# EasyEDA schematic FuzzEffect.json
TITLE: Sheet_1; REV: 1.0; Date: 2020-06-07; Sheet: 1/1; Drawn By: samuelgossner; Company: Your Company
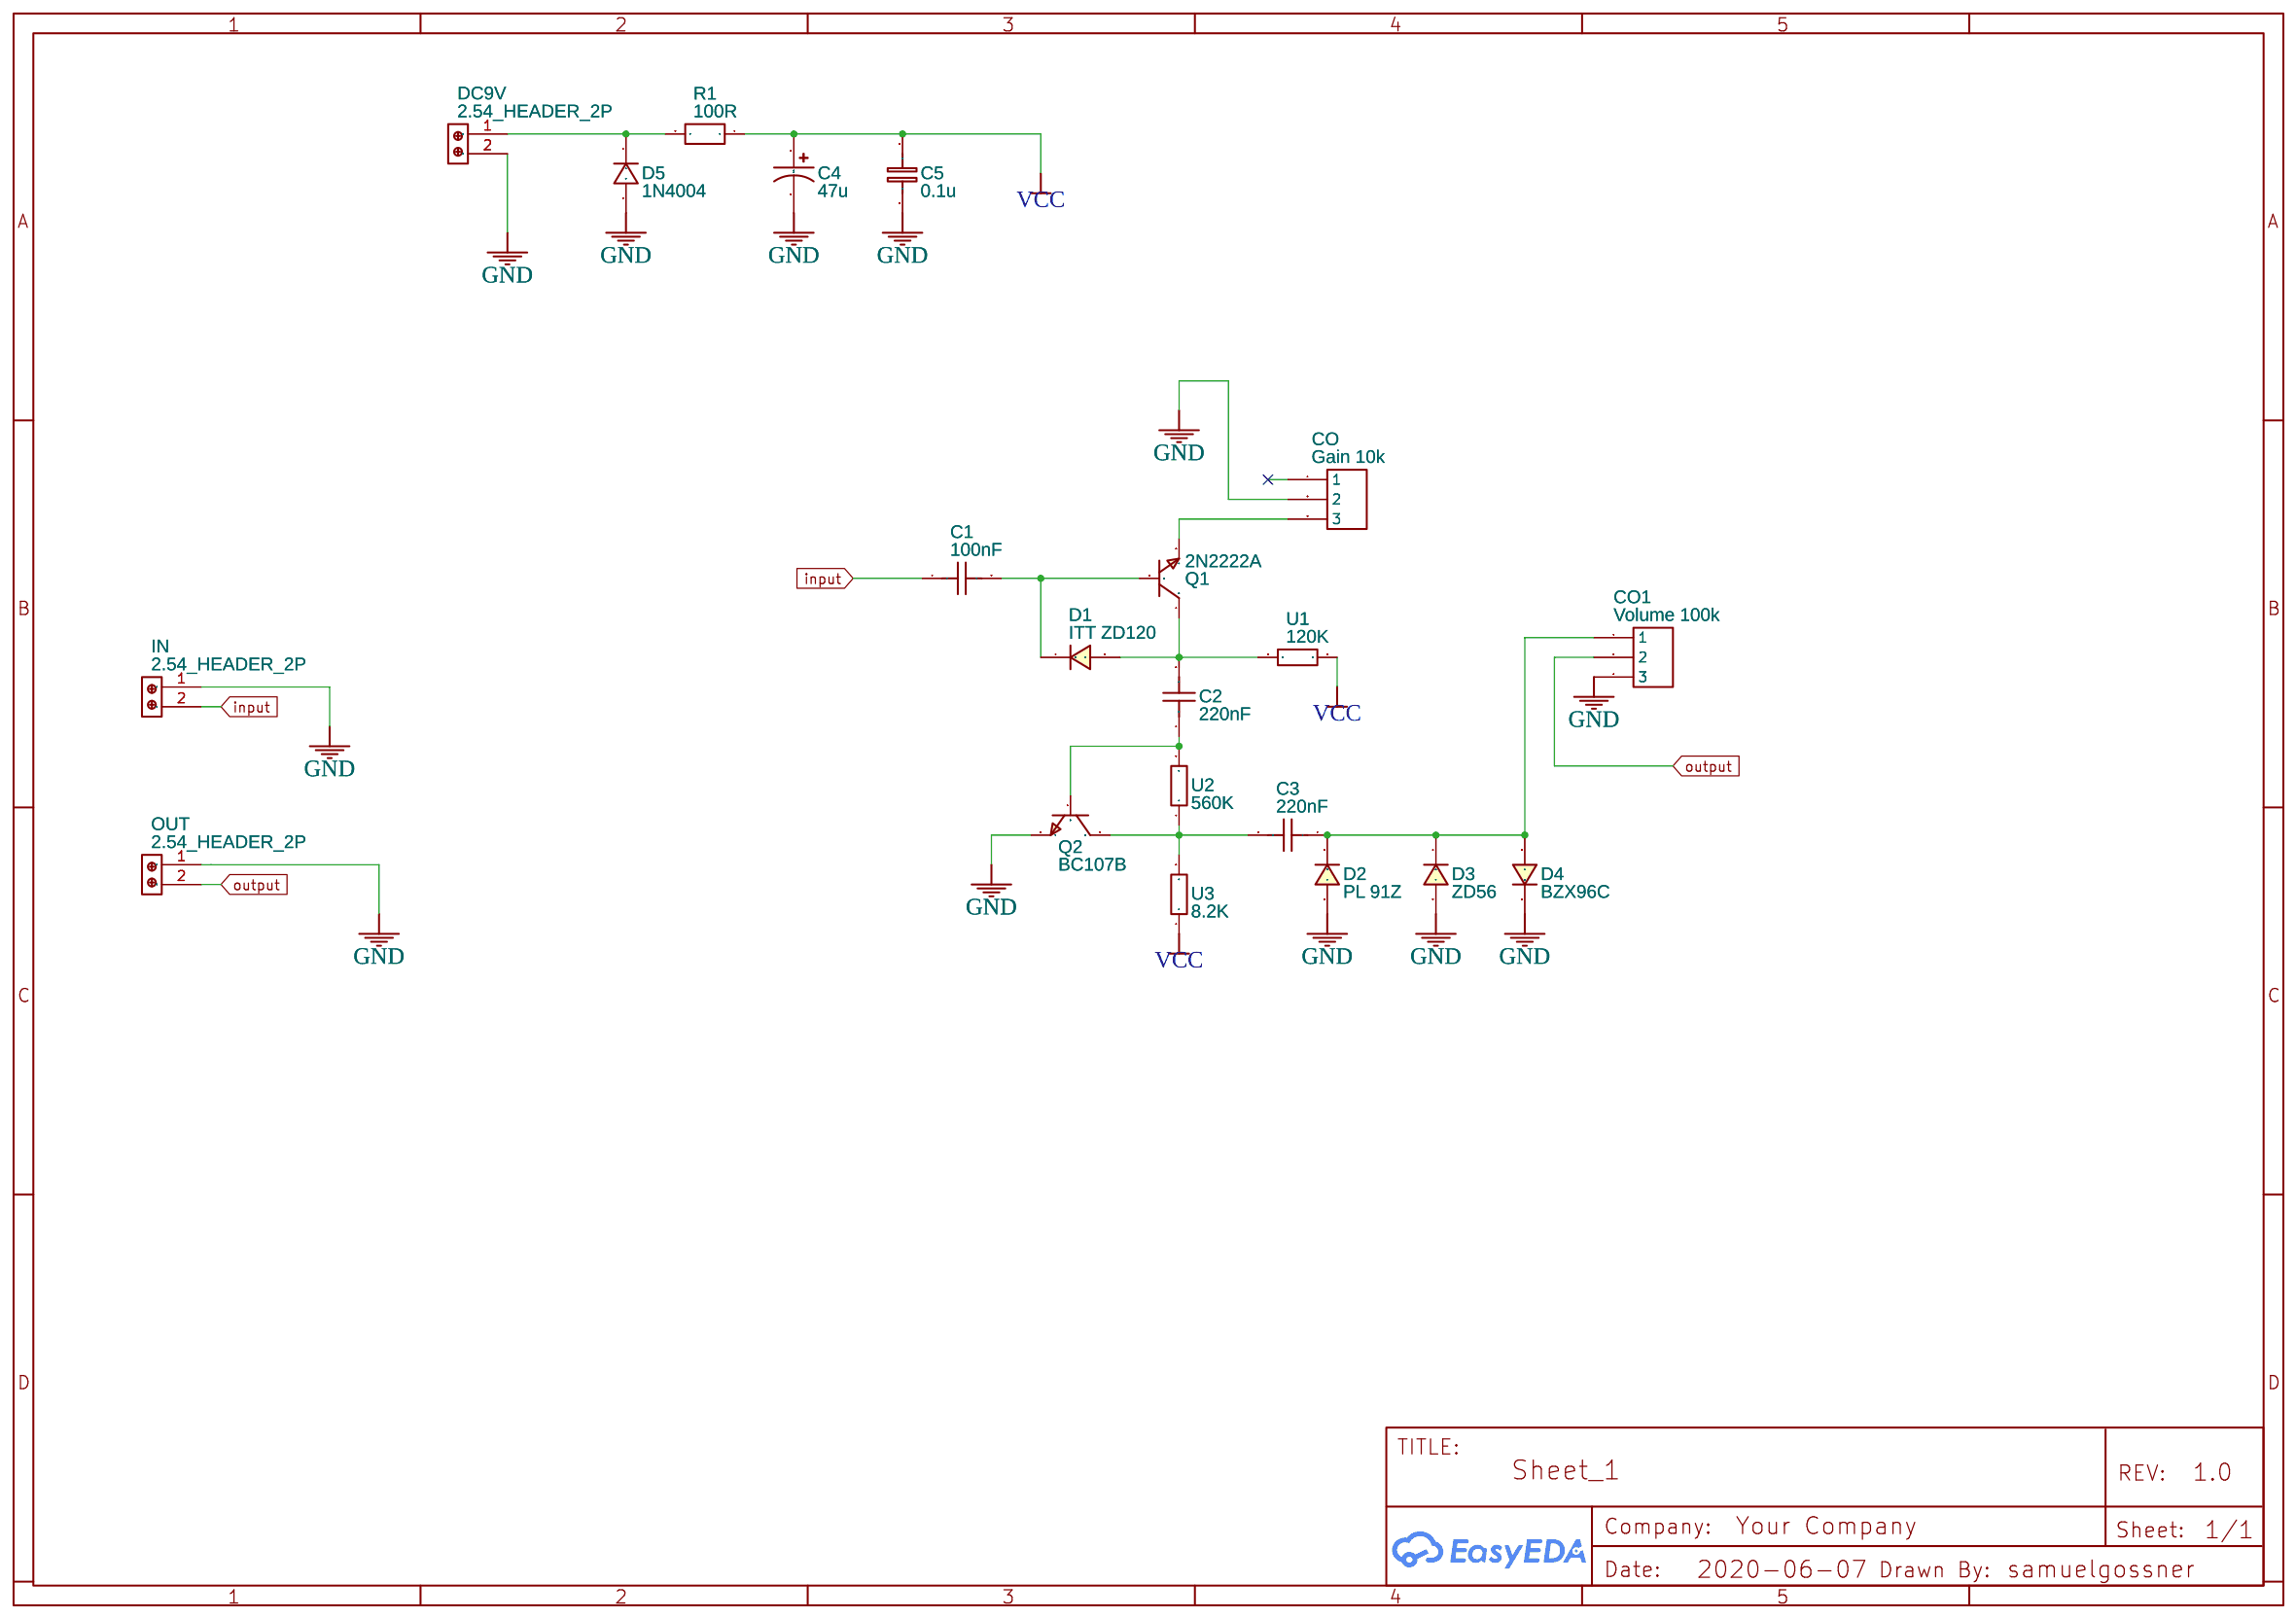
[diagram p0: schematic sheet]

## Parts
C1  100nF  [C0805]
C2  220nF  [C1206]
C3  220nF  [C1206]
C4  47u  [CASE-A_3216]
C5  0.1u  [C0603]
CO  Gain 10k  [HDR-3X1/2.54]
CO1  Volume 100k  [HDR-3X1/2.54]
D1  ITT ZD120  [DO-41_BD2.4-L4.7-P8.70-D0.9-RD]
D2  PL 91Z  [DO-41_BD2.4-L4.7-P8.70-D0.9-RD]
D3  ZD56  [DO-41_BD2.4-L4.7-P8.70-D0.9-RD]
D4  BZX96C  [DO-41_BD2.4-L4.7-P8.70-D0.9-RD]
D5  1N4004  [SOD-123FL_L2.6-W1.6-LS3.4-RD]
DC9V  2.54_HEADER_2P  [2P_2.54]
IN  2.54_HEADER_2P  [2P_2.54]
OUT  2.54_HEADER_2P  [2P_2.54]
Q1  2N2222A  [TO-92-3_L4.8-W3.7-P2.54-R]
Q2  BC107B  [TO-92-3_L4.8-W3.7-P2.54-R]
R1  100R  [R0603]
U1  120K  [RES-SMD_L3.5-W1.5]
U2  560K  [RES-SMD_L3.5-W1.5]
U3  8.2K  [RES-SMD_L3.5-W1.5]

## Library data of the parts
C1 = 0805B104K101: Supplier: LCSC; Manufacturer: WTC; Supplier Part: C77456
C2 C3 = 1206B224K101: Supplier: LCSC; Manufacturer: WTC; Supplier Part: C77515
C4 = C_Tan_SMD_A_US: Contributor: LCEDA_Lib
C5 = C_0603_EU: Contributor: LCEDA_Lib
CO CO1 = Header2.54mm 1*3P copy: Supplier Part: C49257; Supplier: LCSC; Manufacturer: BOOMELE; Manufacturer Part: Header2.54mm 1*3P; image: //image.lceda.cn/szlcsc/C49257.jpg
D1-D4 = FR107-C84243: Supplier: LCSC; Manufacturer: LRC; Manufacturer Part: FR107; image: //image.lceda.cn/szlcsc/C84243.jpg; Supplier Part: C84243
D5 = 1N4148W: Supplier: LCSC; Manufacturer: Tak Cheong; Contributor: LCEDA_Lib; Supplier Part: C129216
DC9V IN OUT = 2.54_HEADER_2P: Supplier Part: undefined; Contributor: Tiberius Vinczi
Q1 Q2 = 2N2222A: Supplier: LCSC; Supplier Part: C358533; Manufacturer: Foshan Blue Rocket Elec; Contributor: LCSC
R1 = R_0603_EU: Contributor: LCEDA_Lib
U1 = MELF-MFR02041/4WS120KΩFT50: Supplier: LCSC; Supplier Part: C265587; Manufacturer: Thunder Component; Manufacturer Part: MElF-MFR02041/4WS120KΩFT50; Contributor: LCSC
U2 = MELF-MFR02041/4WS560KΩFT50: Supplier: LCSC; Supplier Part: C265637; Manufacturer: Thunder Component; Manufacturer Part: MElF-MFR02041/4WS560KΩFT50; Contributor: LCSC
U3 = MELF-MFR02041/4WS8.2KΩFT50: Supplier: LCSC; Supplier Part: C265602; Manufacturer: Thunder Component; Manufacturer Part: MElF-MFR02041/4WS8.2KΩFT50; Contributor: LCSC

## Nets
GND: C4.2 C5.1 CO.2 CO1.3 D2.2(A) D3.2(A) D4.1(C) D5.2 DC9V.2 IN.1 OUT.1 Q2.3(E)
VCC: C4.1 C5.2 R1.1 U1.2 U3.1
input: C1.1 IN.2
output: CO1.2 OUT.2
Net-(C1-2): C1.2 D1.1(C) Q1.2(B)
Net-(C2-1): C2.1 Q2.2(B) U2.2
Net-(C2-2): C2.2 D1.2(A) Q1.1(C) U1.1
Net-(C3-1): C3.1 CO1.1 D2.1(C) D3.1(C) D4.2(A)
Net-(C3-2): C3.2 Q2.1(C) U2.1 U3.2
Net-(CO-3): CO.3 Q1.3(E)
Net-(D5-1): D5.1 DC9V.1 R1.2

Not connected (* = marked no-connect by the designer): CO 1
